# Altium schematic sheet Sensor_Controller.SchDoc
size A4; SheetNumber: 2; SheetTotal: 7
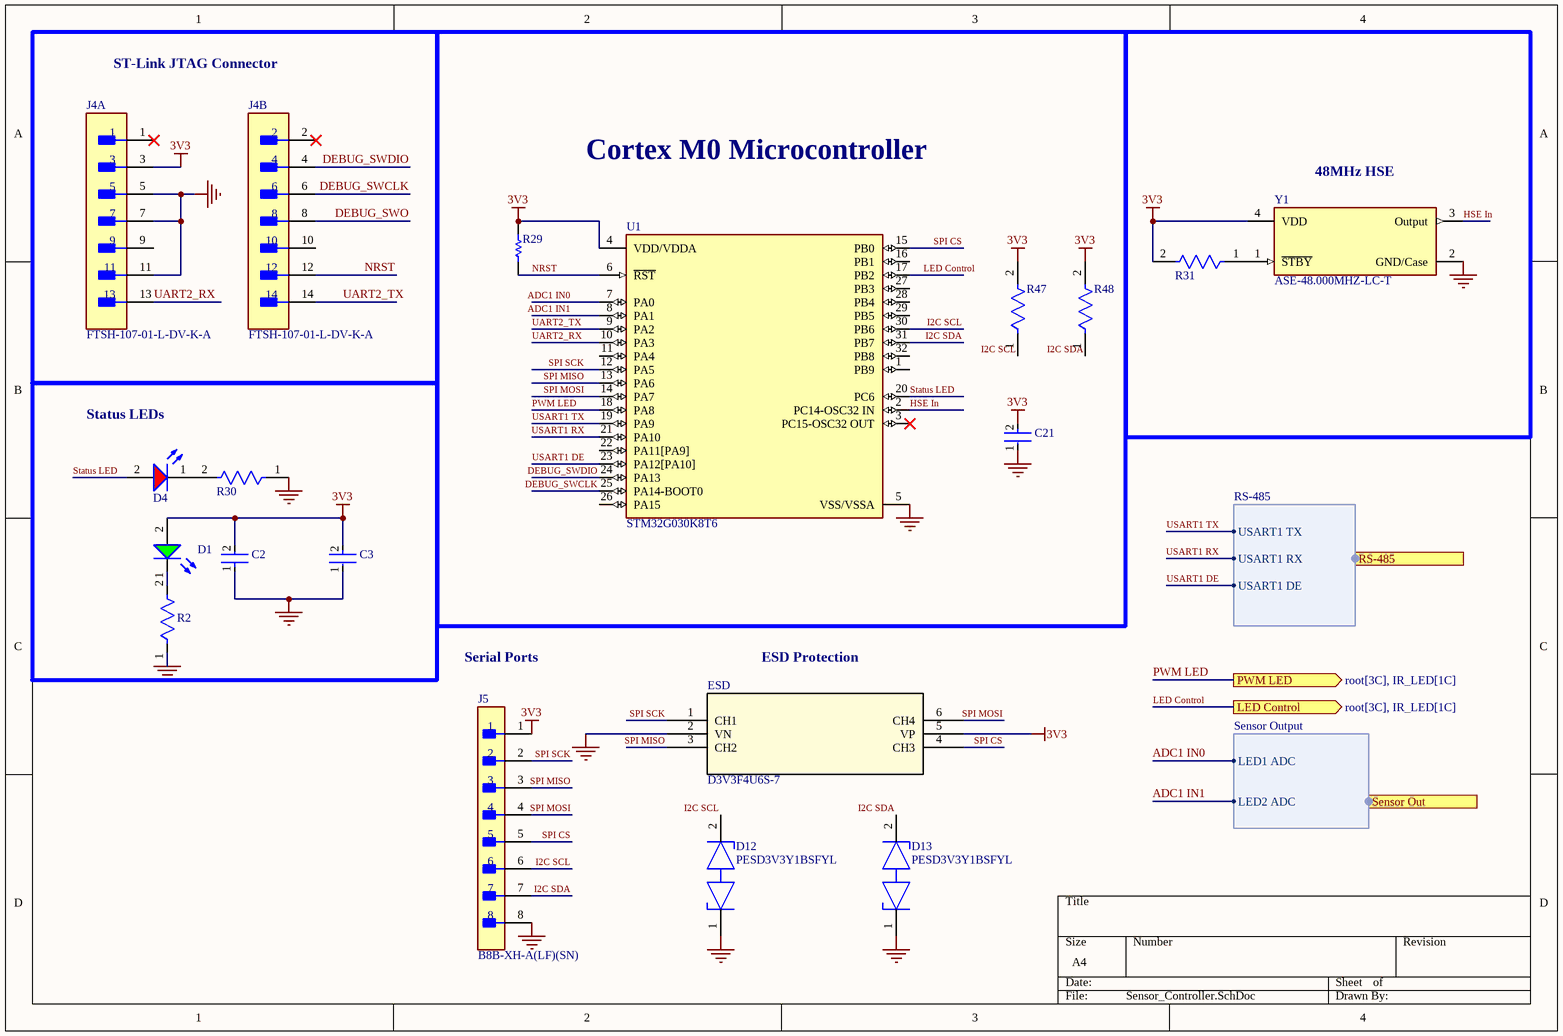
[diagram p0: Sensor_Controller.SchDoc]

## Parts
C2  GRM188R6YA475KE15D  [FP-GRM188-0_2-IPC_C]  (value not drawn)
C3  GRM155R71C104KA88D  [FP-GRM15-MFG]  (value not drawn)
C21  GRM155R71C104KA88D  [FP-GRM15-MFG]  (value not drawn)
D1  150060VS75000  [WL-SMCW_0603_150060xx75000]  (value not drawn)
D4  150060SS75000  [WL-SMCW_0603_150060xx75000]  (value not drawn)
D12  PESD3V3Y1BSFYL  [FP-SOD962-2-CA-MFG]
D13  PESD3V3Y1BSFYL  [FP-SOD962-2-CA-MFG]
ESD  D3V3F4U6S-7  [SOT-363_DIO]
J4  FTSH-107-01-L-DV-K-A  [FP-FTSH-107-01-L-DV-K-A-MFG]  (parts A,B of 2)
J5  B8B-XH-A(LF)(SN)  [FP-B8B-XH-A_LF_SN-MFG]
R2  RC0603FR-0710KL  [FP-RC0603-0_55-IPC_C]  (value not drawn)
R29  TNPW040210K0DEED  [RESC1005X40X20NL05T10]  (value not drawn)
R30  RC0603FR-0710KL  [FP-RC0603-0_55-IPC_C]  (value not drawn)
R31  RC0603FR-0710KL  [FP-RC0603-0_55-IPC_C]  (value not drawn)
R47  CRCW08053K30JNEC  [FP-CRCW0805-e3-IPC_A]  (value not drawn)
R48  CRCW08053K30JNEC  [FP-CRCW0805-e3-IPC_A]  (value not drawn)
U1  STM32G030K8T6  [FP-LQFP32-5V-IPC_A]
Y1  ASE-48.000MHZ-LC-T  [FP-ASE-MFG]

## Blocks framed on the sheet
ST-Link JTAG Connector: J4
Cortex M0 Microcontroller: C21 R29 R47 R48 U1
48MHz HSE: R31 Y1
Status LEDs: C2 C3 D1 D4 R2 R30

## Ports
LED Control (out, see root[3C], IR_LED[1C]), PWM LED (out, see root[3C], IR_LED[1C]), RS-485 (harness RS-485, see root[3B], comms_interface[1D]), Sensor Out (harness Sensor Output, see root[3B], IR_Sensor[4D])

## Harnesses
Sensor Output: LED1 ADC, LED2 ADC
RS-485: USART1 TX, USART1 RX, USART1 DE

## Nets
3V3: C2.2 C3.2 C21.2 D1.2(A) ESD.5(VP) J4.3 J5.1 R29.2 R31.2 R47.2 R48.2 U1.4(VDD/VDDA) Y1.4(VDD)
GND: C2.1 C3.1 C21.1 D12.1 D13.1 ESD.2(VN) J4.5 J4.7 J4.11 J5.8 R2.1 R30.1 U1.5(VSS/VSSA) Y1.2(GND/Case)
ADC1 IN0: U1.7(PA0) ; port Sensor Out.LED1 ADC
ADC1 IN1: U1.8(PA1) ; port Sensor Out.LED2 ADC
DEBUG_SWCLK: J4.6 U1.25(PA14-BOOT0)
DEBUG_SWDIO: J4.4 U1.24(PA13)
DEBUG_SWO: J4.8
HSE In: U1.2(PC14-OSC32_IN) Y1.3(Output)
I2C SCL: D12.2 J5.6 R47.1 U1.30(PB6)
I2C SDA: D13.2 J5.7 R48.1 U1.31(PB7)
LED Control: U1.17(PB2) ; port LED Control
NRST: J4.12 R29.1 U1.6(~{RST})
PWM LED: U1.18(PA8) ; port PWM LED
SPI CS: ESD.4(CH3) J5.5 U1.15(PB0)
SPI MISO: ESD.3(CH2) J5.3 U1.13(PA6)
SPI MOSI: ESD.6(CH4) J5.4 U1.14(PA7)
SPI SCK: ESD.1(CH1) J5.2 U1.12(PA5)
Status LED: D4.2(A) U1.20(PC6)
UART2_RX: J4.13 U1.10(PA3)
UART2_TX: J4.14 U1.9(PA2)
USART1 DE: U1.23(PA12[PA10]) ; port RS-485.USART1 DE
USART1 RX: U1.21(PA10) ; port RS-485.USART1 RX
USART1 TX: U1.19(PA9) ; port RS-485.USART1 TX
NetD1_1: D1.1(K) R2.2
NetD4_1: D4.1(K) R30.2
NetR31_1: R31.1 Y1.1(~{STBY})

Not connected (* = marked no-connect by the designer): J4 1* 2* 9 10; U1 1(PB9) 3(PC15-OSC32_OUT)* 11(PA4) 16(PB1) 22(PA11[PA9]) 26(PA15) 27(PB3) 28(PB4) 29(PB5) 32(PB8)

## Notes on the sheet
- Serial Ports
- ESD Protection

## Library data of the parts
C2 = CMP-2006-02545-2: Chip Multilayer Ceramic Capacitors for General Purpose, 0603, 4.7uF, X5R, 15%, 10%, 35V; Lead Free: Lead Free; Max Operating Temperature: 85°C; Case Code (Imperial): 0603; Capacitance: 4.7uF; Width: 0.8mm; Thickness: 0.031inch; Case Code (Metric): 1608; Min Operating Temperature: -55°C; Voltage Rating (DC): 35V; Dielectric: X5R; Voltage: 35V; Packaging: Tape and Reel; Resistor Type: Ceramic; Weight: 0.000222oz; Mount: Surface Mount; Material: Ceramic; Depth: 0.8mm; Tolerance: 10%; REACH SVHC: No SVHC; Case/Package: 0603; Voltage Rating: 35V; Package Quantity: 4000; Height: 0.8mm; Length: 1.6mm; Termination: SMD/SMT
C3 C21 = CMP-2100-03641-2: CAP CER 0.1UF 16V X7R 0402; Manufacturer: Murata; Standoff Height: 0mm; Tolerance: 10%; Voltage Rating: 16Vdc; Material: Ceramic; Capacitance: 0.10μF; Value: 0.10μF; RoHS: TRUE; Manufacturer Part Number: GRM155R71C104KA88D; Temperature Characteristic: X7R; Octopart: https://octopart.com/grm155r71c104ka88d-murata-196880; Digikey Description: CAP CER 0.1UF 16V X7R 0402; Device Class L3: Ceramic Capacitors; Height: 0.55mm; ComponentLink2Description: Datasheet; Temperature Range Low: -55°C; Ipc Land Pattern Name: CAPC10050X219; ComponentLink2URL: https://search.murata.co.jp/Ceramy/image/img/A01X/G101/ENG/GRM155R71H471KA01-01A.pdf; Device Class L1: Passive Components; Lead Free: yes; Category: Cap; Package: GRM15; Temperature: -55°C to +125°C; Device Class L2: Capacitors; Temperature Range High: +125°C; Mouser Description: 0402 0.1 uF 16V ±10 % Tolerance X7R SMT Multilayer Ceramic Capacitor
D1 = CMP-1426-00006-7: WURTH ELEKTRONIK - 150060VS75000 - LED, Green, SMD, 0603, 30 mA, 2 V, 570 nm; Reverse Voltage: 5V; Power Dissipation: 72mW; Dominant Wavelength: 570nm; Peak Wavelength: 572nm; Forward Current: 100mA; Forward Voltage: 2V; Lens Style: Clear, Rectangular; Test Current: 20mA; Max Junction Temperature (Tj): 95°C; Viewing Angle: 140°; Luminous Intensity: 40mcd; Height: 700µm; Width: 800µm; Length: 1.6mm; Mount: Surface Mount; Min Operating Temperature: -40°C; Max Reverse Voltage (DC): 5V; Case Code (Imperial): 0603; Wavelength: 570nm; Color: Green; REACH SVHC: Unknown; RoHS: Compliant; Max Operating Temperature: 85°C; Packaging: Tape and Reel; Case/Package: 0603; Number of Pins: 2; Case Code (Metric): 1608
D4 = CMP-1426-00004-3: Led, Red, 630 Nm, 1.9 V, 30 Ma, 60 Mcd Rohs Compliant: Yes; Dominant Wavelength: 630nm; Lens Style: Clear, Rectangular; Forward Current: 100mA; Test Current: 20mA; Viewing Angle: 140°; Forward Voltage: 1.9V; Peak Wavelength: 645nm; Max Reverse Voltage (DC): 5V; Luminous Intensity: 60mcd; Color: Red; Height: 700µm; Min Operating Temperature: -40°C; Case Code (Imperial): 0603; REACH SVHC: Unknown; RoHS: Compliant; Length: 1.6mm; Case Code (Metric): 1608; Mount: Surface Mount; Wavelength: 630nm; Packaging: Tape and Reel; Max Operating Temperature: 85°C; Width: 800µm; Case/Package: 0603
D12 D13 = CMP-11424-92175759-2: PESD3V3Y1BSFYL PESD4V0Y1BSF - Extremely low capacitance bidirectional ESD protection diode; Manufacturer Lifecycle Status: RELEASED FOR SUPPLY; Number of Channels: 1; Breakdown Voltage: 4.2V; Clamping Voltage: 3.7V; Capacitance: 240fF; Reverse Standoff Voltage: 3.3V; Height: 320µm; RoHS: Non-Compliant; Ambient Temperature Range High: 125°C; NexarPartId: 92175759; Direction: Bidirectional; Lifecycle Status: Production; Schedule B: 8536300000
ESD = D3V3F4U6S-7: No Description Available; Manufacturer_Name: Diodes Inc; Copyright: Copyright (C) 2026 Ultra Librarian. All rights reserved.; Manufacturer_Part_Number: D3V3F4U6S-7; RefDes: RefDes; Type: Type
J4 = CMP-02766-001414-1: CONN HEADER SMD 14POS 1.27MM; Number of Contacts: 14; Gender: Male; Contact Plating: Gold; Termination: Solder; Lead Free: Lead Free; Contact Material: Bronze; Pitch: 1.27mm; Number of Rows: 2; RoHS Compliant: Yes
J5 = CMP-17438-000015-1: CONN HEADER VERT 8POS 2.5MM; Voltage Rating (AC): 250V; Insulation Resistance: 1GR; Connector Type: Male Pin; Max Current Rating: 3A; Wire/Cable Gauge: 22AWG; Number of Contacts: 8; Contact Resistance: 20mR; Orientation: Straight; Pitch: 2.5mm; Min Operating Temperature: -25°C; Number of Rows: 1; Contact Type: Male Pin; Packaging: Bulk; Lead Free: Lead Free; Max Operating Temperature: 85°C; Housing Material: Polyamide; Voltage Rating: 250V; Series: XH; Mount: Through Hole; Depth: 5.75mm; Contact Material: Brass; Fastening Type: Detent; Color: Natural; Max Voltage Rating (AC): 250V; Number of Positions: 8; Housing Color: White; Contact Plating: Tin; Lead Pitch: 2.5mm; Length: 22.4mm; REACH SVHC: No SVHC; Termination: Press-Fit; Current Rating: 3A
R2 R30 R31 = CMP-2100-03664-2: RES 10K OHM 1% 1/10W 0603; Voltage Rating: 75V; Voltage Rating (DC): 50V; Resistance: 10kR; Power Rating: 100mW; Temperature Coefficient: 100ppm/°C; Depth: 0.8mm; Termination: SMD/SMT; Resistor Type: Thick Film; Series: RC; Construction: Rectangular; Features: Moisture Resistant; Packaging: Tape and Reel; Min Operating Temperature: -55°C; Number of Terminations: 2; Lead Pitch: 0.3mm; RoHS Compliant: Yes; Case/Package: 0603; Resistance Tolerance: 1%; Military Standard: Not; Weight: 7.1E-05oz; Number of Pins: 2; Tolerance: 1%; Length: 1.6mm; Case Code (Imperial): 0603; Lead Free: Lead Free; Width: 0.8mm; Max Power Dissipation: 100mW; Height: 0.45mm; Max Operating Temperature: 155°C; Case Code (Metric): 1608; Size Code: 0603
R29 = CMP-2002-01682-1: Manufacturer: Vishay BCcomponents; Part Number: TNPW040210K0DEED
R47 R48 = CMP-02407-009350-1: RES Thick Film, 3.3kΩ, 5%, 0.125W, 200ppm/°C, 0805; Resistance: 3.3kR; Max Power Dissipation: 125mW; Width: 0.049inch; Contact Plating: Tin; Length: 0.079inch; Height: 0.02inch; Features: Automotive AEC-Q200; Case/Package: 0805; Tolerance: 5%; Min Operating Temperature: -55°C; Number of Terminations: 2; Temperature Coefficient: 200ppm/°C; Lead Free: Lead Free; Packaging: Tape and Reel; Radiation Hardening: No; Max Operating Temperature: 155°C; Package Quantity: 20000; Composition: Thick Film
U1 = CMP-12105-000136-1: IC MCU 32BIT 64KB FLASH 32LQFP; RoHS Compliant: Yes
Y1 = CMP-27762-000273-1: XTAL Oscillator 48MHz ±50ppm CMOS 3.3V 4-SMD 3.2mm x 2.5mm; Min Supply Voltage: 3.135V; Max Supply Voltage: 3.465V; Load Capacitance: 15pF; Max Supply Current: 19mA; Series: ASE; Radiation Hardening: No; Lead Free: Lead Free; Package Quantity: 1000; Frequency: 48MHz; Frequency Stability: 50ppm; Case/Package: SMD/SMT; REACH SVHC: No SVHC; Operating Frequency: 48 MHz; Mount: Surface Mount; Min Operating Temperature: -40°C; Packaging: Tape and Reel; Max Operating Temperature: 85°C; Depth: 2.5mm; Height: 0.047inch; Width: 0.098inch; Length: 3.2mm; Termination: SMD/SMT; Number of Pins: 4; Operating Supply Voltage: 3.3V